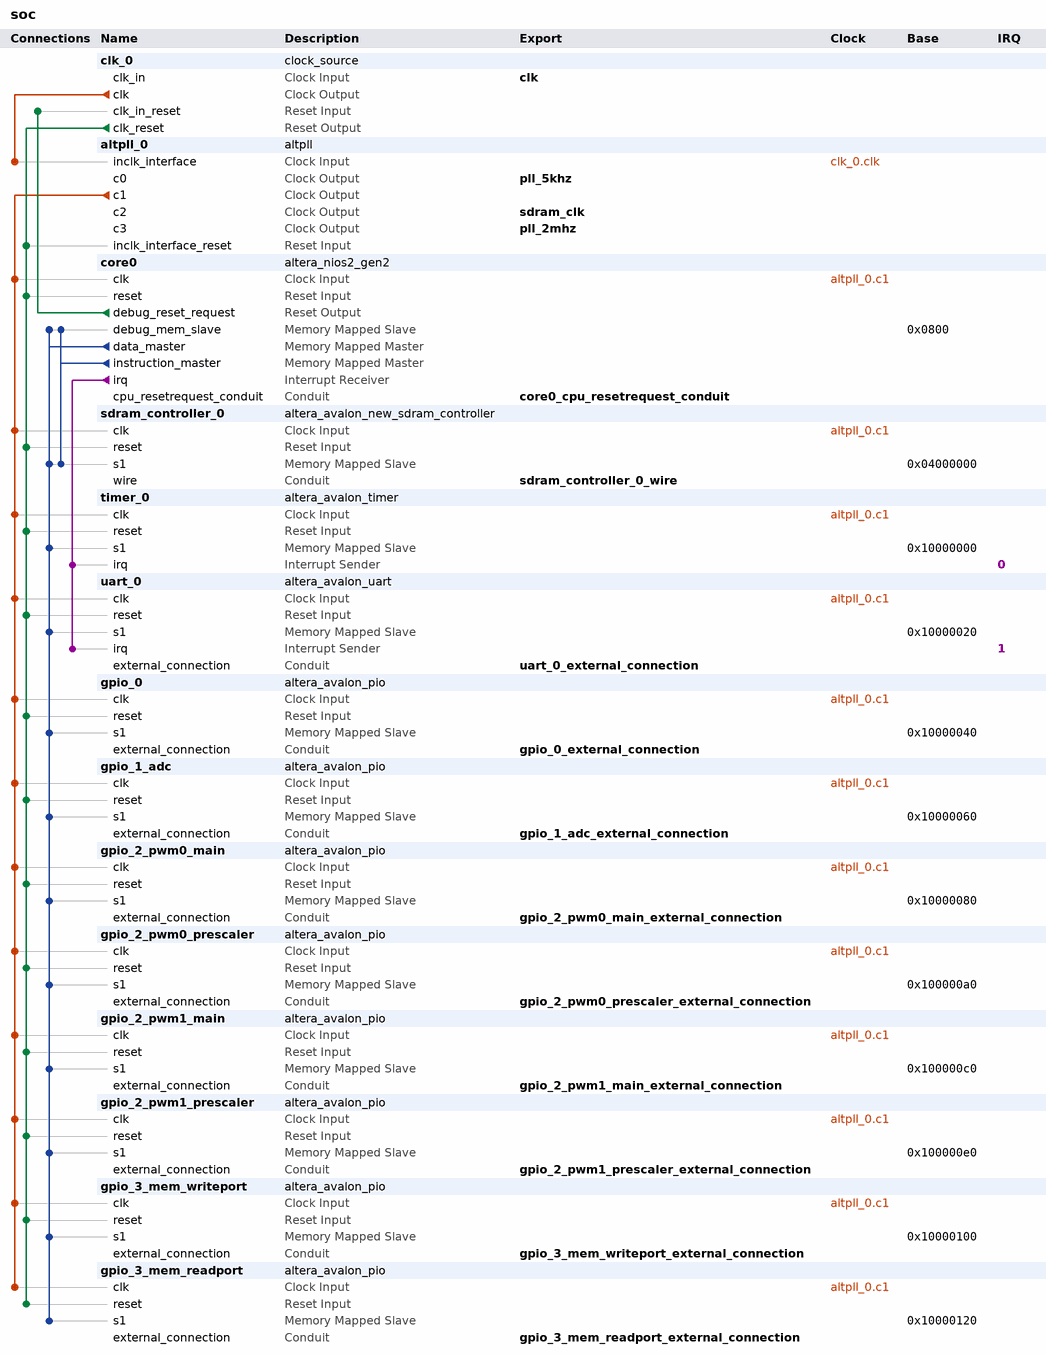
[diagram p0: system contents]
# Platform Designer (Qsys) system soc, Cyclone IV E EP4CE6E22C8
# Parameters at their usual value, and those the tool derives, are not listed.
package require -exact qsys 20.1
create_system soc
set_project_property DEVICE_FAMILY {Cyclone IV E}
set_project_property DEVICE EP4CE6E22C8

add_instance clk_0 clock_source 20.1
set_instance_parameter_value clk_0 clockFrequency 50000000

add_instance altpll_0 altpll 20.1
set_instance_parameter_value altpll_0 CLK0_DIVIDE_BY 10000
set_instance_parameter_value altpll_0 CLK0_MULTIPLY_BY 1
set_instance_parameter_value altpll_0 CLK1_DIVIDE_BY 1
set_instance_parameter_value altpll_0 CLK1_DUTY_CYCLE 50
set_instance_parameter_value altpll_0 CLK1_MULTIPLY_BY 1
set_instance_parameter_value altpll_0 CLK1_PHASE_SHIFT 0
set_instance_parameter_value altpll_0 CLK2_DIVIDE_BY 1
set_instance_parameter_value altpll_0 CLK2_DUTY_CYCLE 50
set_instance_parameter_value altpll_0 CLK2_MULTIPLY_BY 1
set_instance_parameter_value altpll_0 CLK2_PHASE_SHIFT -3556
set_instance_parameter_value altpll_0 CLK3_DIVIDE_BY 25
set_instance_parameter_value altpll_0 CLK3_DUTY_CYCLE 50
set_instance_parameter_value altpll_0 CLK3_MULTIPLY_BY 1
set_instance_parameter_value altpll_0 CLK3_PHASE_SHIFT 0
set_instance_parameter_value altpll_0 INCLK0_INPUT_FREQUENCY 20000
set_instance_parameter_value altpll_0 PORT_ARESET PORT_UNUSED
set_instance_parameter_value altpll_0 PORT_LOCKED PORT_UNUSED
set_instance_parameter_value altpll_0 PORT_clk1 PORT_USED
set_instance_parameter_value altpll_0 PORT_clk2 PORT_USED
set_instance_parameter_value altpll_0 PORT_clk3 PORT_USED

add_instance core0 altera_nios2_gen2 20.1
set_instance_parameter_value core0 cpuReset true
set_instance_parameter_value core0 dcache_size 2048
set_instance_parameter_value core0 exceptionSlave sdram_controller_0.s1
set_instance_parameter_value core0 icache_size 4096
set_instance_parameter_value core0 impl Tiny
set_instance_parameter_value core0 resetSlave sdram_controller_0.s1
set_instance_parameter_value core0 resetrequest_enabled false

add_instance sdram_controller_0 altera_avalon_new_sdram_controller 20.1
set_instance_parameter_value sdram_controller_0 TAC 5.5
set_instance_parameter_value sdram_controller_0 TRCD 20.0
set_instance_parameter_value sdram_controller_0 TRP 20.0
set_instance_parameter_value sdram_controller_0 casLatency 3
set_instance_parameter_value sdram_controller_0 columnWidth 8
set_instance_parameter_value sdram_controller_0 dataWidth 16
set_instance_parameter_value sdram_controller_0 generateSimulationModel false
set_instance_parameter_value sdram_controller_0 model single_Micron_MT48LC4M32B2_7_chip
set_instance_parameter_value sdram_controller_0 numberOfBanks 4
set_instance_parameter_value sdram_controller_0 numberOfChipSelects 1
set_instance_parameter_value sdram_controller_0 powerUpDelay 100.0
set_instance_parameter_value sdram_controller_0 refreshPeriod 15.625
set_instance_parameter_value sdram_controller_0 rowWidth 12

add_instance timer_0 altera_avalon_timer 20.1
set_instance_parameter_value timer_0 period 1
set_instance_parameter_value timer_0 periodUnits MSEC

add_instance uart_0 altera_avalon_uart 20.1
set_instance_parameter_value uart_0 baud 4800
set_instance_parameter_value uart_0 dataBits 8
set_instance_parameter_value uart_0 fixedBaud false
set_instance_parameter_value uart_0 parity NONE
set_instance_parameter_value uart_0 stopBits 1

add_instance gpio_0 altera_avalon_pio 20.1
set_instance_parameter_value gpio_0 bitModifyingOutReg true
set_instance_parameter_value gpio_0 direction Bidir
set_instance_parameter_value gpio_0 width 4

add_instance gpio_1_adc altera_avalon_pio 20.1
set_instance_parameter_value gpio_1_adc bitModifyingOutReg true
set_instance_parameter_value gpio_1_adc direction InOut
set_instance_parameter_value gpio_1_adc width 10

add_instance gpio_2_pwm0_main altera_avalon_pio 20.1
set_instance_parameter_value gpio_2_pwm0_main bitModifyingOutReg true
set_instance_parameter_value gpio_2_pwm0_main direction InOut
set_instance_parameter_value gpio_2_pwm0_main width 14

add_instance gpio_2_pwm0_prescaler altera_avalon_pio 20.1
set_instance_parameter_value gpio_2_pwm0_prescaler bitModifyingOutReg true
set_instance_parameter_value gpio_2_pwm0_prescaler direction Output
set_instance_parameter_value gpio_2_pwm0_prescaler width 32

add_instance gpio_2_pwm1_main altera_avalon_pio 20.1
set_instance_parameter_value gpio_2_pwm1_main bitModifyingOutReg true
set_instance_parameter_value gpio_2_pwm1_main direction InOut
set_instance_parameter_value gpio_2_pwm1_main width 14

add_instance gpio_2_pwm1_prescaler altera_avalon_pio 20.1
set_instance_parameter_value gpio_2_pwm1_prescaler bitModifyingOutReg true
set_instance_parameter_value gpio_2_pwm1_prescaler direction Output
set_instance_parameter_value gpio_2_pwm1_prescaler width 32

add_instance gpio_3_mem_writeport altera_avalon_pio 20.1
set_instance_parameter_value gpio_3_mem_writeport bitModifyingOutReg true
set_instance_parameter_value gpio_3_mem_writeport direction Bidir
set_instance_parameter_value gpio_3_mem_writeport width 20

add_instance gpio_3_mem_readport altera_avalon_pio 20.1
set_instance_parameter_value gpio_3_mem_readport bitModifyingOutReg true
set_instance_parameter_value gpio_3_mem_readport direction InOut
set_instance_parameter_value gpio_3_mem_readport width 20

# connections
add_connection altpll_0.c1 core0.clk clock
add_connection altpll_0.c1 gpio_0.clk clock
add_connection altpll_0.c1 gpio_1_adc.clk clock
add_connection altpll_0.c1 gpio_2_pwm0_main.clk clock
add_connection altpll_0.c1 gpio_2_pwm0_prescaler.clk clock
add_connection altpll_0.c1 gpio_2_pwm1_main.clk clock
add_connection altpll_0.c1 gpio_2_pwm1_prescaler.clk clock
add_connection altpll_0.c1 gpio_3_mem_readport.clk clock
add_connection altpll_0.c1 gpio_3_mem_writeport.clk clock
add_connection altpll_0.c1 sdram_controller_0.clk clock
add_connection altpll_0.c1 timer_0.clk clock
add_connection altpll_0.c1 uart_0.clk clock
add_connection clk_0.clk altpll_0.inclk_interface clock
add_connection clk_0.clk_reset altpll_0.inclk_interface_reset reset
add_connection clk_0.clk_reset core0.reset reset
add_connection clk_0.clk_reset gpio_0.reset reset
add_connection clk_0.clk_reset gpio_1_adc.reset reset
add_connection clk_0.clk_reset gpio_2_pwm0_main.reset reset
add_connection clk_0.clk_reset gpio_2_pwm0_prescaler.reset reset
add_connection clk_0.clk_reset gpio_2_pwm1_main.reset reset
add_connection clk_0.clk_reset gpio_2_pwm1_prescaler.reset reset
add_connection clk_0.clk_reset gpio_3_mem_readport.reset reset
add_connection clk_0.clk_reset gpio_3_mem_writeport.reset reset
add_connection clk_0.clk_reset sdram_controller_0.reset reset
add_connection clk_0.clk_reset timer_0.reset reset
add_connection clk_0.clk_reset uart_0.reset reset
add_connection core0.debug_reset_request clk_0.clk_in_reset reset
add_connection core0.data_master core0.debug_mem_slave avalon
set_connection_parameter_value core0.data_master/core0.debug_mem_slave baseAddress 0x0800
add_connection core0.data_master gpio_0.s1 avalon
set_connection_parameter_value core0.data_master/gpio_0.s1 baseAddress 0x10000040
add_connection core0.data_master gpio_1_adc.s1 avalon
set_connection_parameter_value core0.data_master/gpio_1_adc.s1 baseAddress 0x10000060
add_connection core0.data_master gpio_2_pwm0_main.s1 avalon
set_connection_parameter_value core0.data_master/gpio_2_pwm0_main.s1 baseAddress 0x10000080
add_connection core0.data_master gpio_2_pwm0_prescaler.s1 avalon
set_connection_parameter_value core0.data_master/gpio_2_pwm0_prescaler.s1 baseAddress 0x100000a0
add_connection core0.data_master gpio_2_pwm1_main.s1 avalon
set_connection_parameter_value core0.data_master/gpio_2_pwm1_main.s1 baseAddress 0x100000c0
add_connection core0.data_master gpio_2_pwm1_prescaler.s1 avalon
set_connection_parameter_value core0.data_master/gpio_2_pwm1_prescaler.s1 baseAddress 0x100000e0
add_connection core0.data_master gpio_3_mem_readport.s1 avalon
set_connection_parameter_value core0.data_master/gpio_3_mem_readport.s1 baseAddress 0x10000120
add_connection core0.data_master gpio_3_mem_writeport.s1 avalon
set_connection_parameter_value core0.data_master/gpio_3_mem_writeport.s1 baseAddress 0x10000100
add_connection core0.data_master sdram_controller_0.s1 avalon
set_connection_parameter_value core0.data_master/sdram_controller_0.s1 baseAddress 0x04000000
add_connection core0.data_master timer_0.s1 avalon
set_connection_parameter_value core0.data_master/timer_0.s1 baseAddress 0x10000000
add_connection core0.data_master uart_0.s1 avalon
set_connection_parameter_value core0.data_master/uart_0.s1 baseAddress 0x10000020
add_connection core0.instruction_master core0.debug_mem_slave avalon
set_connection_parameter_value core0.instruction_master/core0.debug_mem_slave baseAddress 0x0800
add_connection core0.instruction_master sdram_controller_0.s1 avalon
set_connection_parameter_value core0.instruction_master/sdram_controller_0.s1 baseAddress 0x04000000
add_connection core0.irq timer_0.irq interrupt
set_connection_parameter_value core0.irq/timer_0.irq irqNumber 0
add_connection core0.irq uart_0.irq interrupt
set_connection_parameter_value core0.irq/uart_0.irq irqNumber 1

# exported interfaces
add_interface clk clock sink
set_interface_property clk EXPORT_OF clk_0.clk_in
add_interface core0_cpu_resetrequest_conduit conduit end
set_interface_property core0_cpu_resetrequest_conduit EXPORT_OF core0.cpu_resetrequest_conduit
add_interface gpio_0_external_connection conduit end
set_interface_property gpio_0_external_connection EXPORT_OF gpio_0.external_connection
add_interface gpio_1_adc_external_connection conduit end
set_interface_property gpio_1_adc_external_connection EXPORT_OF gpio_1_adc.external_connection
add_interface gpio_2_pwm0_main_external_connection conduit end
set_interface_property gpio_2_pwm0_main_external_connection EXPORT_OF gpio_2_pwm0_main.external_connection
add_interface gpio_2_pwm0_prescaler_external_connection conduit end
set_interface_property gpio_2_pwm0_prescaler_external_connection EXPORT_OF gpio_2_pwm0_prescaler.external_connection
add_interface gpio_2_pwm1_main_external_connection conduit end
set_interface_property gpio_2_pwm1_main_external_connection EXPORT_OF gpio_2_pwm1_main.external_connection
add_interface gpio_2_pwm1_prescaler_external_connection conduit end
set_interface_property gpio_2_pwm1_prescaler_external_connection EXPORT_OF gpio_2_pwm1_prescaler.external_connection
add_interface gpio_3_mem_readport_external_connection conduit end
set_interface_property gpio_3_mem_readport_external_connection EXPORT_OF gpio_3_mem_readport.external_connection
add_interface gpio_3_mem_writeport_external_connection conduit end
set_interface_property gpio_3_mem_writeport_external_connection EXPORT_OF gpio_3_mem_writeport.external_connection
add_interface pll_2mhz clock source
set_interface_property pll_2mhz EXPORT_OF altpll_0.c3
add_interface pll_5khz clock source
set_interface_property pll_5khz EXPORT_OF altpll_0.c0
add_interface sdram_clk clock source
set_interface_property sdram_clk EXPORT_OF altpll_0.c2
add_interface sdram_controller_0_wire conduit end
set_interface_property sdram_controller_0_wire EXPORT_OF sdram_controller_0.wire
add_interface uart_0_external_connection conduit end
set_interface_property uart_0_external_connection EXPORT_OF uart_0.external_connection

set_interconnect_requirement {$system} qsys_mm.clockCrossingAdapter HANDSHAKE
set_interconnect_requirement {$system} qsys_mm.enableEccProtection FALSE
set_interconnect_requirement {$system} qsys_mm.insertDefaultSlave FALSE
set_interconnect_requirement {$system} qsys_mm.maxAdditionalLatency 1

save_system soc.qsys
